# EAGLE design QIF (EAGLE 7.4.0)
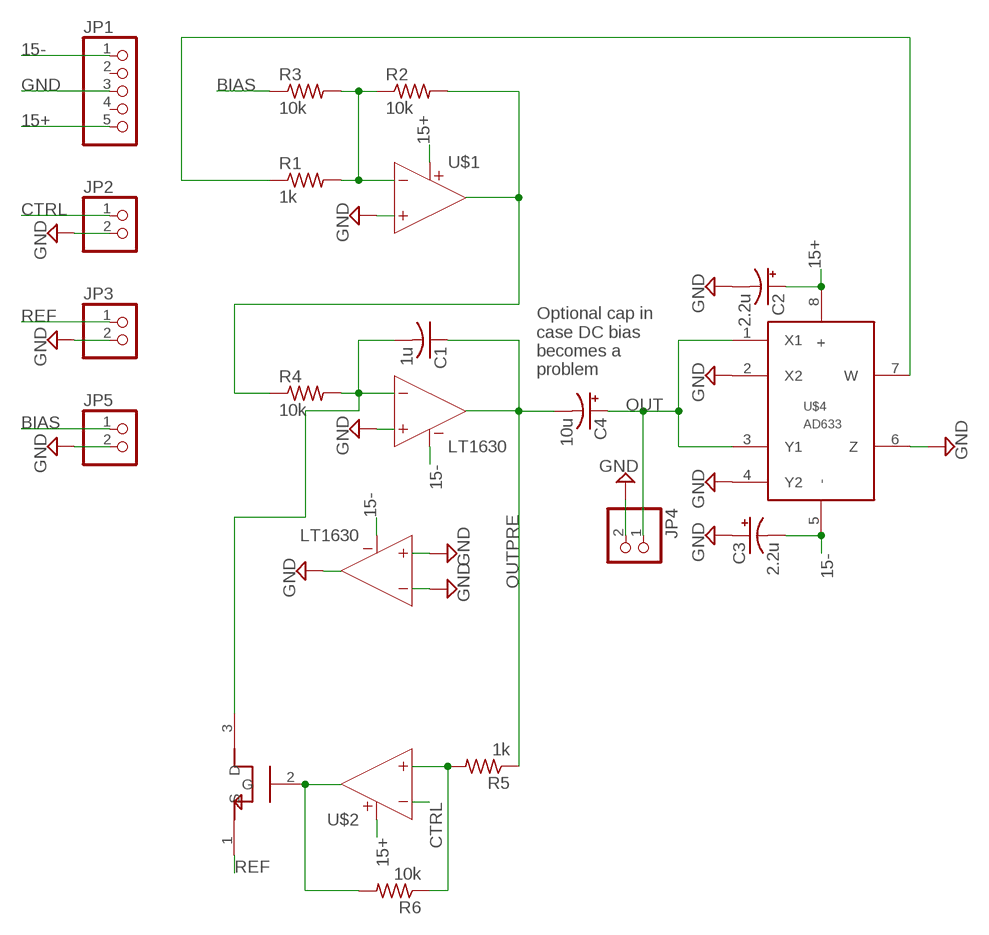
[diagram p0: schematic, sheet 1]

## Parts
C1  1u  C-US050-030X075  [C050-030X075]
C2  2.2u  CPOL-USE2,5-6E  [E2,5-6E]
C3  2.2u  CPOL-USE2,5-6E  [E2,5-6E]
C4  10u  CPOL-USE2.5-6  [E2,5-6]
JP1  PINHD-1X5  [1X05]
JP2  PINHD-1X2  [1X02]
JP3  PINHD-1X2  [1X02]
JP4  PINHD-1X2  [1X02]
JP5  PINHD-1X2  [1X02]
R1  1k  R-US_0207/10  [0207/10]
R2  10k  R-US_0309/V  [0309V]
R3  10k  R-US_0207/10  [0207/10]
R4  10k  R-US_0207/10  [0207/10]
R5  1k  R-US_0207/10  [0207/10]
R6  10k  R-US_0309/V  [0309V]
U$1  LT1630  [DIL8]
U$2  LT1630  [DIL8]
U$3  2N7000  [TO-92]
U$4  AD633  [DIL8]

## Nets
15+: C2.+ JP1.5 U$1.8(V+) U$2.8(V+) U$4.8(+)
15-: C3.- JP1.1 U$1.4(V-) U$2.4(V-) U$4.5(-)
BIAS: JP5.1 R3.1
CTRL: JP2.1 U$2.2(IN-)
GND: C2.- C3.+ JP1.3 JP2.2 JP3.2 JP4.2 JP5.2 U$1.3(IN+) U$1.5(IN+1) U$2.5(IN+1) U$2.6(IN-1) U$2.7(OUT1) U$4.2(X2) U$4.4(Y2) U$4.6(Z)
N$1: C1.2 R4.2 U$1.6(IN-1) U$3.3(D)
N$3: R1.2 R2.1 R3.2 U$1.2(IN-)
N$4: R5.2 R6.1 U$2.3(IN+)
N$5: R2.2 R4.1 U$1.1(OUT)
N$6: R6.2 U$2.1(OUT) U$3.2(G)
N$7: R1.1 U$4.7(W)
OUT: C4.+ JP4.1 U$4.1(X1) U$4.3(Y1)
OUTPRE: C1.1 C4.- R5.1 U$1.7(OUT1)
REF: JP3.1 U$3.1(S)
Unconnected: JP1.2 JP1.4

## Notes on the sheet
- Optional cap in
  case DC bias
  becomes a
  problem

## Library data of the parts
C1 = rcl:C-US: CAPACITOR, American symbol
C2-C4 = rcl:CPOL-US: POLARIZED CAPACITOR, American symbol
JP1 = pinhead:PINHD-1X5: PIN HEADER
JP2-JP5 = pinhead:PINHD-1X2: PIN HEADER
R1-R6 = rcl:R-US_: RESISTOR, American symbol
U$1 U$2 = Cust_LTextended:LT1630
U$3 = Cust_Transistor:2N7000
U$4 = Cust_AnalogDevices:AD633

## Board
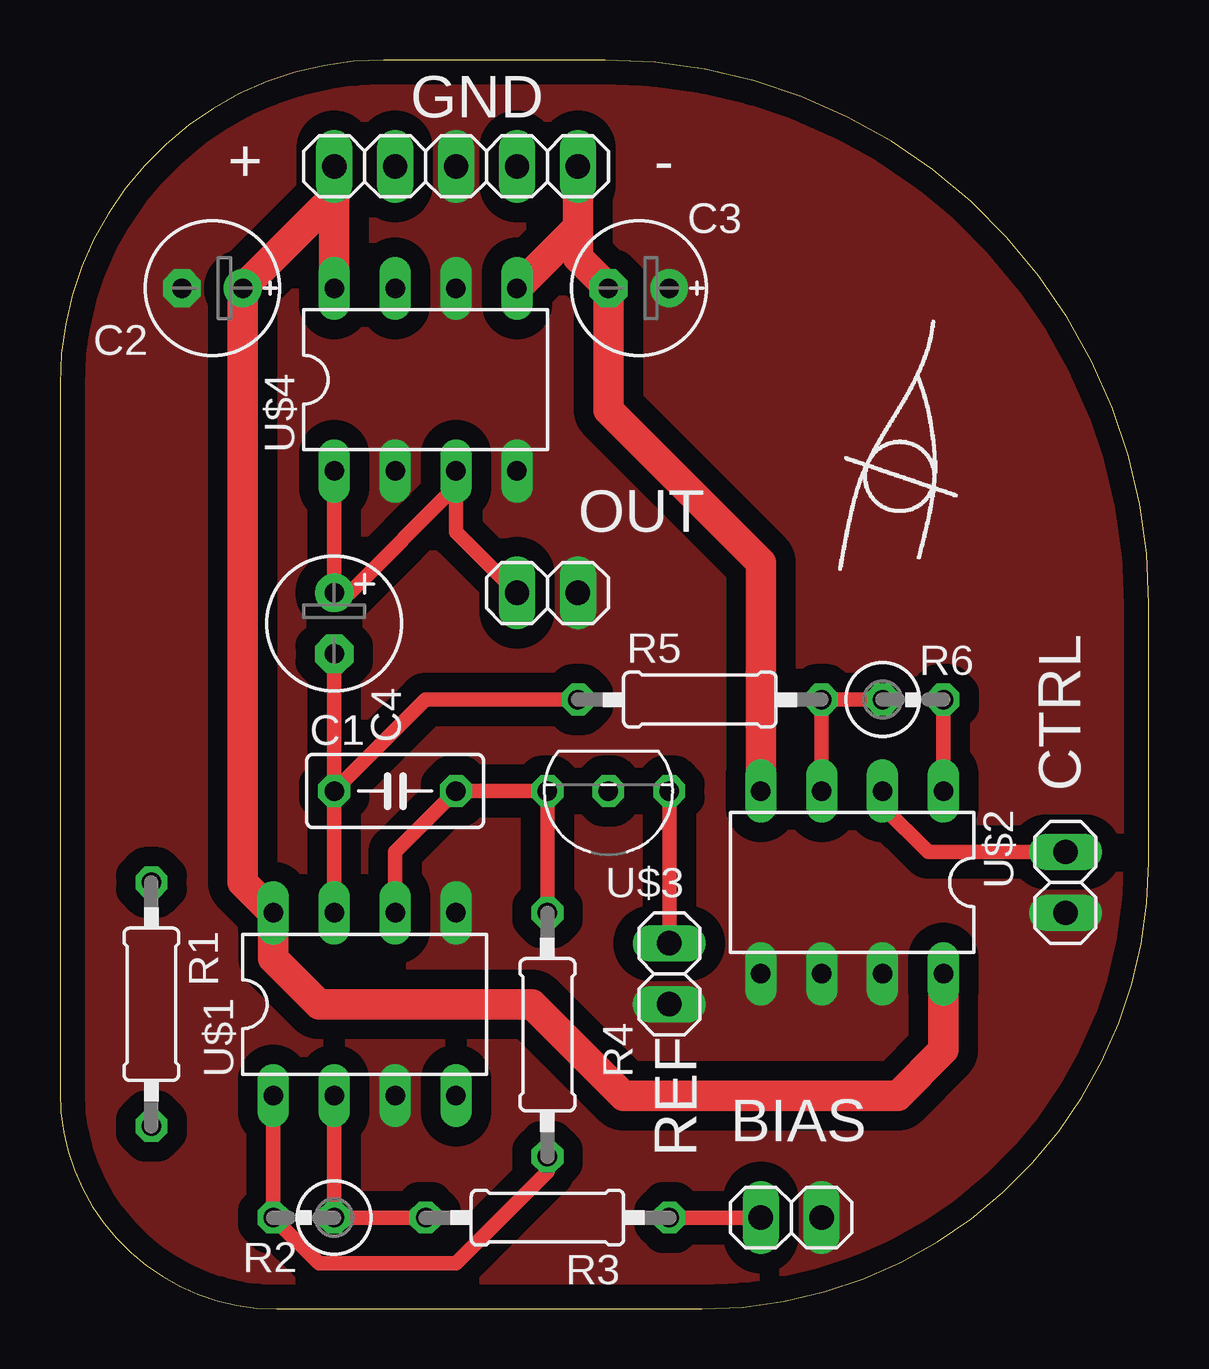
[diagram p1: board, top side]
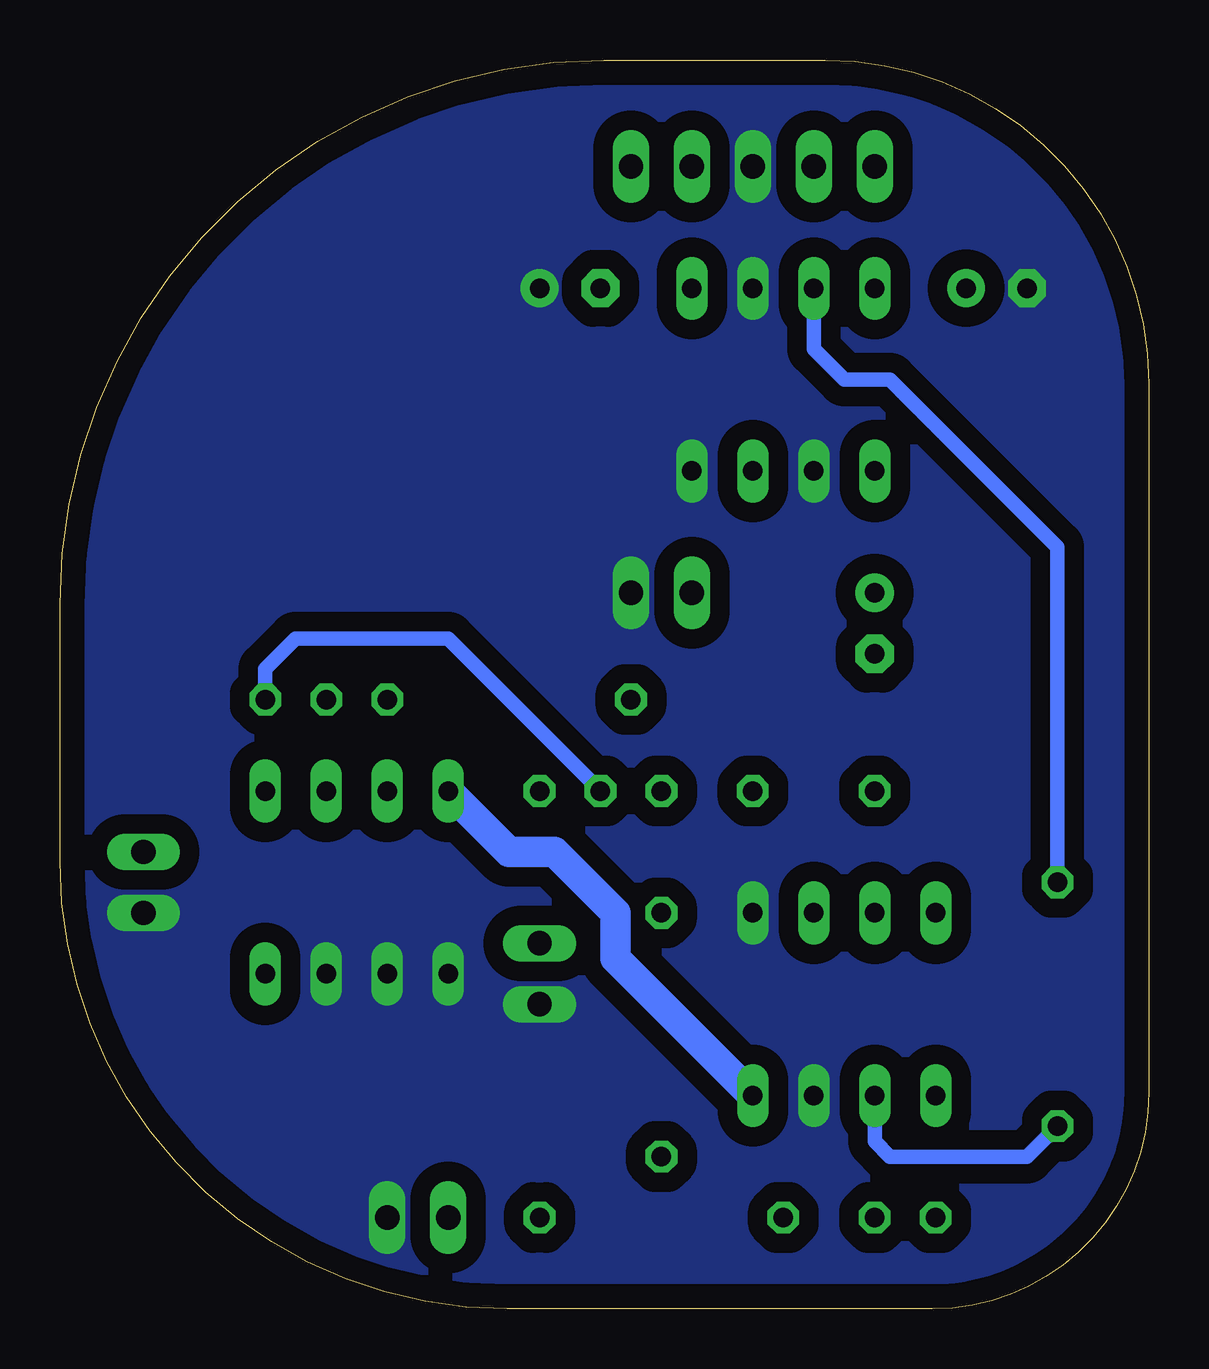
[diagram p2: board, bottom side, seen from below]

Size 45.39 x 52.06 mm. Coordinates in mm from the lower left corner, seen from the top.
Outline: 0,38.57 0,9.02 arc90 9.02,0 26.75,0 arc90 45.39,18.64 45.39,29.39 arc90 22.72,52.06 13.49,52.06 arc90 0,38.57
Copper layers (1*16): Top 0.035mm / dielectric 1.5mm / Bottom 0.035mm
Design rules "default": minimum track width 10mil, minimum drill 24mil, track to track 8mil, track to pad 8mil, pad to pad 8mil, via to via 8mil, smd to smd 8mil, copper to edge 40mil, drill to drill 8mil, minimum pad ring 10mil, minimum via ring 8mil, stop-mask expansion 4mil, vias tented up to drill 0mil, thermal gap 10mil

### Footprints (pad centres in the part's own frame; a part is rotated, then mirrored left to right if it is on the bottom)
C050-030X075 = drill 0.813 octagon: 1 -2.54,0; 2 2.54,0
E2,5-6E = drill 0.813 pad 1.575: + -1.27,0 | drill 0.813 pad 1.575 octagon: - 1.27,0
E2,5-6 = drill 0.813 pad 1.6: + -1.27,0 | drill 0.813 pad 1.6 octagon: - 1.27,0
1X05 = drill 1.016 long: 1 -5.08,0; 2 -2.54,0; 3 0,0; 4 2.54,0; 5 5.08,0
1X02 = drill 1.016 long: 1 -1.27,0; 2 1.27,0
0207/10 = drill 0.813 octagon: 1 -5.08,0; 2 5.08,0
0309V = drill 0.813 octagon: 1 -1.27,0; 2 1.27,0
DIL8 = drill 0.813 long: 1 -3.81,-3.81; 2 -1.27,-3.81; 3 1.27,-3.81; 4 3.81,-3.81; 5 3.81,3.81; 6 1.27,3.81; 7 -1.27,3.81; 8 -3.81,3.81
TO-92 = drill 0.813 octagon: 1 -2.54,0; 2 0,0; 3 2.54,0

### Placement (x,y rotation side)
C1  13.97,21.59 0 top
C2  6.35,42.55 180 top
C3  24.13,42.55 180 top
C4  11.43,28.57 270 top
JP1  16.51,47.62 180 top
JP2  41.91,17.78 270 top
JP3  25.4,13.97 270 top
JP4  20.32,29.84 0 top
JP5  30.48,3.81 0 top
R1  3.81,12.7 270 top
R2  10.16,3.81 180 top
R3  20.32,3.81 180 top
R4  20.32,11.43 90 top
R5  26.67,25.4 0 top
R6  35.56,25.4 0 top
U$1  12.7,12.7 0 top
U$2  33.02,17.78 180 top
U$3  22.86,21.59 180 top
U$4  15.24,38.73 0 top
U$5  [LOGO]  35.13,34.75 90 top

### Tracks (layer width: path | path; a pad name or v marks a point on that pad's centre or on a via)
15+
  Top 1.27: U$4.8 JP1.5 11.43,46.36 C2.+ 7.62,17.78 U$1.8 8.89,14.6 10.8,12.7 19.68,12.7 23.49,8.89 34.93,8.89 36.83,10.79 U$2.8
15-
  Top 1.27: U$4.5 21.59,45.09 JP1.1 21.59,43.81 C3.- 22.86,37.46 29.21,31.12 U$2.4
  Bottom 1.27: U$2.4 26.67,19.05 24.77,19.05 22.23,16.51 22.23,14.6 U$1.4
BIAS
  Top 0.61: R3.1 JP5.1
CTRL
  Top 0.61: U$2.2 34.29,20.95 36.2,19.05 JP2.1
GND
  pour Top (isolate 0.813, no thermals): -1.27,53.34 46.99,53.34 46.99,-1.27 -1.27,-1.27
  pour Bottom (isolate 0.813, no thermals): -1.27,53.34 46.99,53.34 46.99,-1.27 -1.27,-1.27
N$1
  Top 0.61: R4.2 U$3.3 C1.2 13.97,19.05 U$1.6
N$3
  Top 0.61: U$1.2 R2.1 R3.2
  Bottom 0.61: R1.2 5.08,6.35 10.8,6.35 11.43,6.98 U$1.2
N$4
  Top 0.61: R6.1 R5.2 U$2.3
N$5
  Top 0.61: U$1.1 R2.2 10.8,1.9 16.51,1.9 20.32,5.71 R4.1
N$6
  Top 0.61: U$2.1 R6.2
  Bottom 0.61: U$3.2 29.21,27.94 35.56,27.94 36.83,26.67 R6.2
N$7
  Bottom 0.61: R1.1 3.81,31.75 10.8,38.73 12.7,38.73 13.97,40 U$4.7
OUT
  Top 0.61: U$4.1 C4.+ 12.06,29.84 16.51,34.29 U$4.3 16.51,32.38 JP4.1
OUTPRE
  Top 0.61: U$1.7 C1.1 | C1.1 C4.- | R5.1 15.24,25.4 C1.1
REF
  Top 0.61: JP3.1 U$3.1

### Text on the board
tPlace: + | GND | - | OUT | CTRL | BIAS | REF
tDocu: This circuit is especially / sensitive to noise, / so use bypass caps. | Apply: / - REF = 0.1 V / - CTRL = 0.5 V